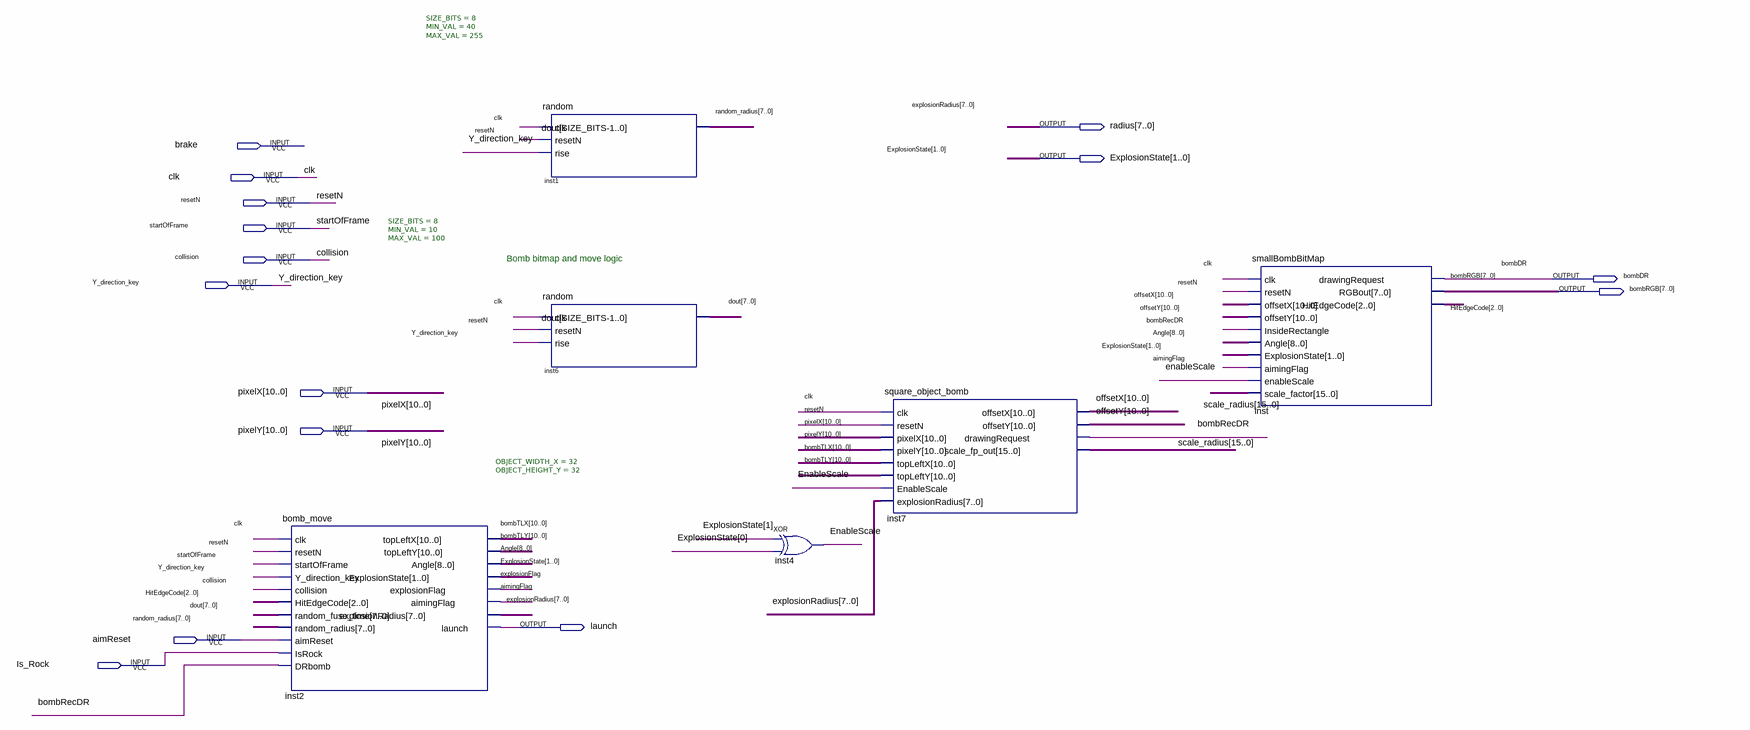
[diagram p0: schematic sheet]
// Quartus schematic Bomb_Block.bdf as structural Verilog: 6 symbols, 15 pins
module Bomb_Block (
  input  brake,
  input  clk,
  input  resetN,
  input  startOfFrame,
  input  collision,
  input  Y_direction_key,
  input  [10:0] pixelX,
  input  [10:0] pixelY,
  input  aimReset,
  input  Is_Rock,
  output [7:0] radius,
  output [1:0] ExplosionState,
  output bombDR,
  output [7:0] bombRGB,
  output launch
);

  wire aimingFlag, bombRecDR, EnableScale, explosionFlag;
  wire [2:0] HitEdgeCode;
  wire [7:0] dout, random_radius;
  wire [8:0] Angle;
  wire [10:0] bombTLX, bombTLY, offsetX, offsetY;
  wire [15:0] scale_radius;

  bomb_move #(.OBJECT_WIDTH_X(32), .OBJECT_HEIGHT_Y(32)) inst2 (
    .clk(clk), .resetN(resetN), .startOfFrame(startOfFrame), .Y_direction_key(Y_direction_key),
    .collision(collision), .HitEdgeCode(HitEdgeCode), .random_fuse_time(dout), .random_radius(random_radius),
    .aimReset(aimReset), .IsRock(Is_Rock), .DRbomb(bombRecDR), .topLeftX(bombTLX), .topLeftY(bombTLY),
    .Angle(Angle), .ExplosionState(ExplosionState), .explosionFlag(explosionFlag), .aimingFlag(aimingFlag),
    .explosionRadius(radius), .launch(launch));
  random #(.SIZE_BITS(8), .MIN_VAL(40), .MAX_VAL(255)) inst1 (
    .clk(clk), .resetN(resetN), .rise(Y_direction_key), .dout(random_radius));
  random #(.SIZE_BITS(8), .MIN_VAL(10), .MAX_VAL(100)) inst6 (
    .clk(clk), .resetN(resetN), .rise(Y_direction_key), .dout(dout));
  xor inst4 (EnableScale, ExplosionState[1], ExplosionState[0]);
  square_object_bomb inst7 (
    .clk(clk), .resetN(resetN), .pixelX(pixelX), .pixelY(pixelY), .topLeftX(bombTLX), .topLeftY(bombTLY),
    .EnableScale(EnableScale), .explosionRadius(radius), .offsetX(offsetX), .offsetY(offsetY),
    .drawingRequest(bombRecDR), .scale_fp_out(scale_radius));
  smallBombBitMap inst (
    .clk(clk), .resetN(resetN), .offsetX(offsetX), .offsetY(offsetY), .InsideRectangle(bombRecDR),
    .Angle(Angle), .ExplosionState(ExplosionState), .aimingFlag(aimingFlag), .enableScale(EnableScale),
    .scale_factor(scale_radius), .drawingRequest(bombDR), .RGBout(bombRGB), .HitEdgeCode(HitEdgeCode));

  // Other names for the same wires on the sheet: explosionRadius[7:0] = radius

  // Notes on the sheet:
  //   Bomb bitmap and move logic
endmodule
